# EasyEDA Pro project ESP32_Expanded_Board.epro

# Schematic Schematic1_2
Board Name: 3.28新-tps5450降压-带总线舵机控制; Create Date: 2025-02-16; Page Name: P1; Project Name: ESP32S3控制板最终版; Schematic Name: Schematic1_2; Update Date: 2025-03-29; Company: 嘉立创EDA; Page Size: A4; Version: V1.0
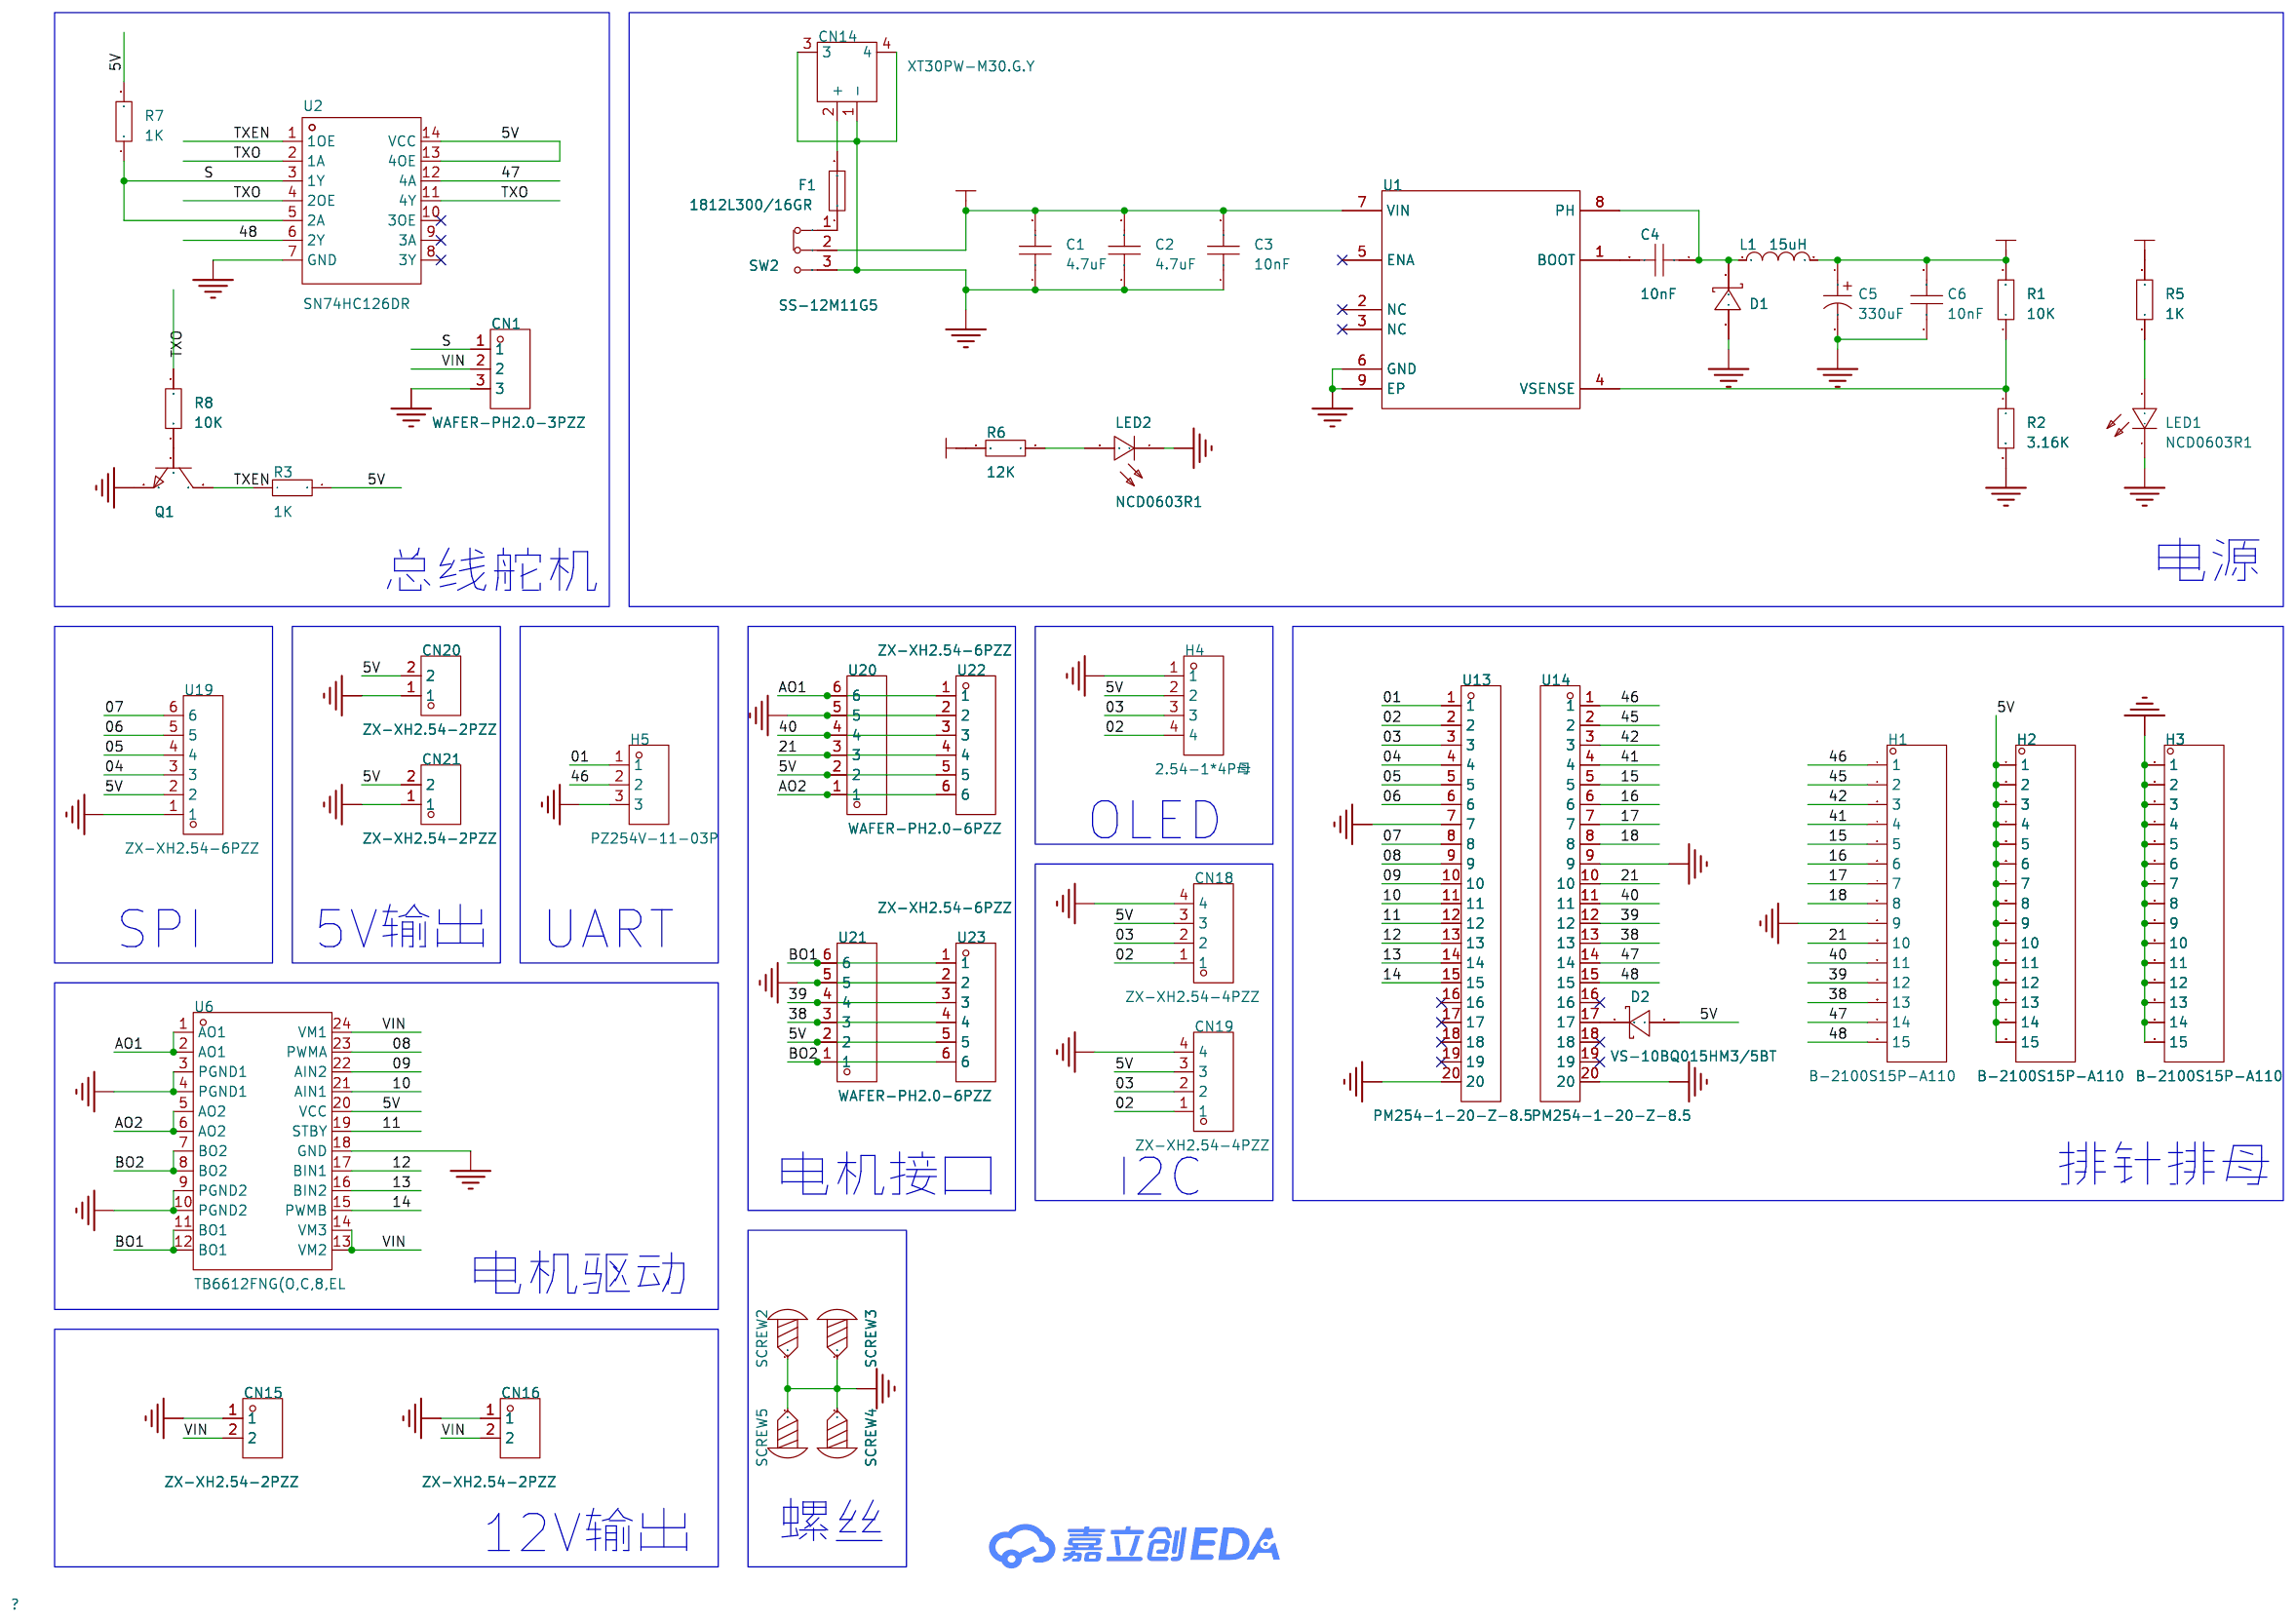
[diagram p0: schematic sheet]

## Parts
C1  4.7uF  [C0603]
C2  4.7uF  [C0603]
C3  10nF  [C0603]
C4  10nF  [C0603]
C5  330uF  [CAP-SMD_BD10.0-L10.3-W10.3-LS11.3-FD-1]
C6  10nF  [C0603]
CN1  WAFER-PH2.0-3PZZ  [CONN-TH_PH2.0D-L-3P]
CN14  XT30PW-M30.G.Y  [CONN-TH_XT30PW-M]
CN15  ZX-XH2.54-2PZZ  [CONN-TH_2P-P2.50_HX25003-2A]
CN16  ZX-XH2.54-2PZZ  [CONN-TH_2P-P2.50_HX25003-2A]
CN18  ZX-XH2.54-4PZZ  [CONN-TH_4P-P2.50_4PIN]
CN19  ZX-XH2.54-4PZZ  [CONN-TH_4P-P2.50_4PIN]
CN20  ZX-XH2.54-2PZZ  [CONN-TH_2P-P2.50_HX25003-2A]
CN21  ZX-XH2.54-2PZZ  [CONN-TH_2P-P2.50_HX25003-2A]
D1  B540C-13-F  [SMC_L7.1-W6.2-LS8.1-RD]
D2  VS-10BQ015HM3/5BT  [SMB_L4.6-W3.6-LS5.3-RD]
F1  1812L300/16GR  [F1812]
H1  B-2100S15P-A110  [HDR-TH_15P-P2.54-V-M]
H2  B-2100S15P-A110  [HDR-TH_15P-P2.54-V-M]
H3  B-2100S15P-A110  [HDR-TH_15P-P2.54-V-M]
H4  2.54-1*4P母  [HDR-TH_4P-P2.54-V-F]
H5  PZ254V-11-03P  [HDR-TH_3P-P2.54-V-M]
L1  15uH  [IND-SMD_L11.5-W10.0_FXL1040]
LED1  NCD0603R1  [LED0603-RD_RED]
LED2  NCD0603R1  [LED0603-RD_RED]
Q1  -  [S8050_SOT-23]
R1  10K  [R0603]
R2  3.16K  [R0603]
R3  1K  [R0603]
R5  1K  [R0603]
R6  12K  [R0603]
R7  1K  [R0603]
R8  10K  [R0603]
SCREW2  -  [M2螺丝]
SCREW3  -  [M2螺丝]
SCREW4  -  [M2螺丝]
SCREW5  -  [M2螺丝]
SW2  SS-12M11G5  [SW-TH_XKB_SS-12M11XX]
U1  TPS5450DDAR  [SOP-8_L4.9-W3.9-P1.27-LS6.0-BL-EP]
U2  SN74HC126DR  [SOIC-14_L8.7-W3.9-P1.27-LS6.0-BL]
U6  TB6612FNG(O,C,8,EL  [SSOP-24_L8.4-W5.8-P0.65-LS7.8-BL]
U13  PM254-1-20-Z-8.5  [HDR-TH_20P-P2.54-V-F-2]
U14  PM254-1-20-Z-8.5  [HDR-TH_20P-P2.54-V-F-2]
U19  ZX-XH2.54-6PZZ  [CONN-TH_6P-P2.50_ZX-XH2.54-6PZZ]
U20  WAFER-PH2.0-6PZZ  [CONN-TH_6P-P2.00_PH2.0-6P]
U21  WAFER-PH2.0-6PZZ  [CONN-TH_6P-P2.00_PH2.0-6P]
U22  ZX-XH2.54-6PZZ  [CONN-TH_6P-P2.50_ZX-XH2.54-6PZZ]
U23  ZX-XH2.54-6PZZ  [CONN-TH_6P-P2.50_ZX-XH2.54-6PZZ]

## Library data of the parts
C1-C4 C6 = CAP_0603: Supplier Footprint: 0603
C5 = RVT330UF50V167RV085: 容值:330uF;精度:±20%;额定电压:50V;纹波电流:170mA@120Hz;等效串联电阻:-;; LCSC Part Name: 330uF ±20% 50V; Supplier Part: C5155333; Manufacturer: KNSCHA(科尼盛); Supplier Footprint: SMD,D10xL10.2mm; JLCPCB Part Class: 扩展库; Datasheet: https://atta.szlcsc.com/upload/public/pdf/source/20220901/E823696ADB10689AF3B7DFC19BA73CDE.pdf; Supplier: LCSC; Tolerance: ±20%; Rated Voltage: 50V; Ripple Current: 170mA@120Hz; φD: 10mm; L: 10.2mm; Lifetime @ Temp: 2000hrs@105℃; Operating Temperature: -55℃~+105℃
CN1 = WAFER-PH2.0-3PZZ: 插针结构:1x3P;间距:2mm;安装方式:直插;参考系列:PH;总PIN数:3P;排数:1;每排PIN数:3;额定电流:2A;工作温度范围:-25℃~+85℃;; LCSC Part Name: PH 2.0mm 1x3P 直插; Supplier Part: C5359600; Manufacturer: XUNPU(讯普); Supplier Footprint: 插件,P=2mm; JLCPCB Part Class: 扩展库; Supplier: LCSC; Pins Structure: 1x3P; Pitch: 2mm; Mounting Style: 直插; Reference Series: PH; Number of Pins: 3P; Number of Rows: 1; Number of PINs Per Row: 3; Current Rating (Max): 2A; Operating Temperature Range: -25℃~+85℃
CN14 = XT30PW-M30.G.Y: 类别:-;类型1:-;; LCSC Part Name: AMASS(艾迈斯)航模插头 卧式弯脚 XT30PW-M公头; Supplier Part: C431092; Manufacturer: AMASS(艾迈斯); JLCPCB Part Class: 扩展库; Datasheet: https://atta.szlcsc.com/upload/public/pdf/source/20220222/6A9F22F7850E25B33E1BE430ADF8560B.pdf; Supplier: LCSC; Type: 航模插头; RatedVoltage: DC 500V; InterfaceType: 公头; RatedCurrent: 15A; RecommendedWireGauge: 16/18/20AWG; contact resistance: 1.2mΩ; specifications: 2pin
CN15 CN16 CN20 CN21 = ZX-XH2.54-2PZZ: 插针结构:1x2P;间距:2.54mm;安装方式:直插;参考系列:XH;总PIN数:2P;排数:1;每排PIN数:2;行距:-;额定电流:3A;触头材质:黄铜;触头镀层:锡;工作温度范围:-25℃~+85℃;; Supplier Part: C7429632; Manufacturer: Megastar(兆星); Supplier Footprint: 插件,P=2.54mm; JLCPCB Part Class: 扩展库; Datasheet: https://atta.szlcsc.com/upload/public/pdf/source/20230619/19BA6947230AA44A04D3EDD65E618FD0.pdf; Supplier: LCSC; Pins Structure: 1x2P; Pitch: 2.54mm; Mounting Style: 直插; Reference Series: XH; Number of Pins: 2P; Number of Rows: 1; Number of PINs Per Row: 2; Current Rating (Max): 3A; Contact Material: 黄铜; Contact Plating: 锡; Operating Temperature Range: -25℃~+85℃
CN18 CN19 = ZX-XH2.54-4PZZ: 插针结构:1x4P;间距:2.54mm;安装方式:直插;参考系列:XH;总PIN数:4P;排数:1;每排PIN数:4;行距:-;额定电流:3A;触头材质:黄铜;触头镀层:锡;工作温度范围:-25℃~+85℃;; Supplier Part: C7429634; Manufacturer: Megastar(兆星); Supplier Footprint: 插件,P=2.5mm; JLCPCB Part Class: 扩展库; Datasheet: https://atta.szlcsc.com/upload/public/pdf/source/20230619/B529A2163E0159A644AB3383D208FB03.pdf; Supplier: LCSC; Pins Structure: 1x4P; Pitch: 2.54mm; Mounting Style: 直插; Reference Series: XH; Number of Pins: 4P; Number of Rows: 1; Number of PINs Per Row: 4; Current Rating (Max): 3A; Contact Material: 黄铜; Contact Plating: 锡; Operating Temperature Range: -25℃~+85℃
D1 = B540C-13-F: 正向压降(Vf):550mV@5A;直流反向耐压(Vr):40V;平均整流电流(Io):5A;; LCSC Part Name: 电压:40V 电流:5A; Supplier Part: C72264; Manufacturer: DIODES(美台); Supplier Footprint: SMC(DO-214AB); JLCPCB Part Class: 扩展库; Datasheet: https://atta.szlcsc.com/upload/public/pdf/source/20171023/C134461_15087453602301052556.pdf; Supplier: LCSC; Forward Voltage (Vf@If): 550mV@5A; Reverse Voltage (Vr): 40V; Average Rectified Current (Io): 5A; Reverse Leakage Current (Ir): 500uA@40V
D2 = VS-10BQ015HM3/5BT: 正向压降(Vf):210mV@1A;直流反向耐压(Vr):15V;整流电流:1A;; LCSC Part Name: 电压:15V 电流:1A; Supplier Part: C413465; Manufacturer: VISHAY(威世); Supplier Footprint: DO-214AA(SMB); JLCPCB Part Class: 扩展库; Datasheet: https://atta.szlcsc.com/upload/public/pdf/source/20190819/C413465_3D2B1A8C7366D4425AB887DF85498F89.pdf; Supplier: LCSC; Forward Voltage (Vf@If): 210mV@1A; Reverse Voltage (Vr): 15V; Rectified Current: 1A; Reverse Leakage Current (Ir): 500uA@15V
F1 = 1812L300/16GR: 最大电压:16V;最大电流:40A;保持电流:3A;跳闸电流:5A;; LCSC Part Name: 16V 3A 自恢复保险丝; Supplier Part: C18198349; Manufacturer: LUTE(陆特); Supplier Footprint: 1812; JLCPCB Part Class: 扩展库; Datasheet: https://atta.szlcsc.com/upload/public/pdf/source/20230926/57461D6230B1C3E982BE957E074F147E.pdf; Supplier: LCSC; Operating Voltage (Max): 16V; Current Rating (Max): 40A; Hold Current: 3A; Trip Current: 5A; Power Dissipation: 1.4W; Resistance - Initial (Ri) (Min): 10mΩ; Resistance - Post Trip (R1) (Max): 50mΩ; Maximum Time to Trip: 4s; Operating Temperature: -40℃~+85℃
H1-H3 = B-2100S15P-A110: 插针结构:1x15P;间距:2.54mm;行距:-;圆针/方针:-;安装类型:直插;排数:单排;总PIN位数:15P;额定电流:-;额定电压:-;配合针长度:6mm;塑高:2.54mm;端接针长度:3mm;触头材质:黄铜;触头镀层:-;工作温度范围:-40℃~+105℃;颜色:黑色;; LCSC Part Name: 间距:2.54mm 1x15P 直插; Supplier Part: C124373; Manufacturer: Ckmtw(灿科盟); Supplier Footprint: 插件,P=2.54mm; JLCPCB Part Class: 扩展库; Datasheet: https://atta.szlcsc.com/upload/public/pdf/source/20170821/C124381_1503303309126901535.pdf; Supplier: LCSC; Pin Structure: 1x15P; Pitch: 2.54mm; Mounting Type: 直插; Number of Rows: 单排; Number of Pins: 15P; Length of Mating Pin: 6mm; Insulation Height: 2.54mm; Length of End Connection Pin: 3mm; Contact Material: 黄铜; Operating Temperature Range: -40℃~+105℃; Color: 黑色
H4 = 2.54-1*4P母: 插孔结构:1x4P;间距:2.54mm;行距:-;圆孔/方孔:方孔;安装类型:直插;排数:单排;总孔位数:4P;额定电流:3A;额定电压:-;插孔方向:顶部;塑高:-;触头材质:青铜;触头镀层:-;工作温度范围:-40℃~+105℃;焊接温度(最大值):-;; LCSC Part Name: 间距:2.54mm 1x4P 直插; Supplier Part: C2718488; Manufacturer: BOOMELE(博穆精密); Supplier Footprint: 插件,P=2.54mm; JLCPCB Part Class: 扩展库; Datasheet: https://atta.szlcsc.com/upload/public/pdf/source/20210301/C2718488_F4427B881E42CAA8DDB0B1C12B3A522C.pdf; Supplier: LCSC; Holes Structure: 1x4P; Pitch: 2.54mm; Circular Hole / Square Hole: 方孔; Mounting Type: 直插; Number of Rows: 单排; Number of Holes: 4P; Current Rating (Max): 3A; Holes Direction: 顶部; Contact Material: 青铜; Operating Temperature Range: -40℃~+105℃
H5 = PZ254V-11-03P: 插针结构:1x3P;间距:2.54mm;行距:-;圆针/方针:方针;安装类型:直插;排数:单排;总PIN位数:3P;额定电流:3A;额定电压:250V;配合针长度:6mm;塑高:2.5mm;端接针长度:3mm;工作温度范围:-40℃~+105℃;颜色:黑色;; LCSC Part Name: 间距:2.54mm 1x3P 直插 方针; Supplier Part: C2937625; Manufacturer: XFCN(兴飞); Supplier Footprint: 插件,P=2.54mm; JLCPCB Part Class: 扩展库; Datasheet: https://atta.szlcsc.com/upload/public/pdf/source/20200309/C492402_8335C3D49C4E4C618838D59BB1D024C1.pdf; Supplier: LCSC; Pin Structure: 1x3P; Pitch: 2.54mm; Circluar Pins/Square Pins: 方针; Mounting Type: 直插; Number of Rows: 单排; Number of Pins: 3P; Current Rating (Max): 3A; Voltage Rating (Max): 250V; Length of Mating Pin: 6mm; Insulation Height: 2.5mm; Length of End Connection Pin: 3mm; Operating Temperature Range: -40℃~+105℃; Color: 黑色
L1 = FXL1040-150-M: 电感值:15uH;精度:±20%;额定电流:6.5A;饱和电流(Isat):7A;类型:一体成型电感;; LCSC Part Name: 15uH ±20% 7A; Supplier Part: C475916; Manufacturer: cjiang(长江微电); Supplier Footprint: SMD,11.5x10mm; JLCPCB Part Class: 扩展库; Datasheet: https://atta.szlcsc.com/upload/public/pdf/source/20230516/54757DC4DB76FADFA619F78143C06647.pdf; Supplier: LCSC; Tolerance: ±20%; Rated Current: 6.5A; Saturation Current (Isat): 7A; DC Resistance (DCR): 45mΩ; Type: 一体成型电感
LED1 LED2 = NCD0603R1_C84263: 灯头类型:-;发光颜色:红色;正向电压(VF):1.6V~2.6V;功率:65mW;正向电流:20mA;主波长:615nm~630nm;二极管配置:独立二极管;透镜颜色:无色透明透镜;色温:-;发光强度:80mcd~220mcd;发光角度:130°;载带方式:-;工作温度:-30℃~+85℃;; Supplier Part: C84263; Manufacturer: 国星光电; Supplier Footprint: 0603; JLCPCB Part Class: 扩展库; Datasheet: https://atta.szlcsc.com/upload/public/pdf/source/20200820/C84263_DABC6A75E58F576973B407FDBA283D60.pdf; Supplier: LCSC; Emitted Color: 红色; Forward Voltage (VF): 1.6V~2.6V; Power Dissipation: 65mW; Forward Current: 20mA; Dominant Wavelength: 615nm~630nm; Diode Configuration: 独立二极管; Lens Color: 无色透明透镜; Luminous Intensity: 80mcd~220mcd; Viewing Angle: 130°; Operating Temperature: -30℃~+85℃
Q1 = S8050_SOT_NPN: Supplier Footprint: SOT-23
R1-R3 R5-R8 = Res_0603: Supplier Footprint: 0603
SCREW2-SCREW5 = M2螺丝: Supplier Footprint: 插件
SW2 = SS-12M11G5: 电路结构:单刀双掷;安装方式:直插;开关颜色:黑色;额定电流(DC):6A;额定电压(DC):120V;额定电流(AC):6A;额定电压(AC):120V;机械寿命:1万次;; LCSC Part Name: 柄长5mm 直插双档 滑动开关; Supplier Part: C2879839; Manufacturer: XKB Connectivity(中国星坤); Supplier Footprint: 插件; JLCPCB Part Class: 扩展库; Datasheet: https://atta.szlcsc.com/upload/public/pdf/source/20211009/04BB83002759118EAC16A9AC01596A50.pdf; Supplier: LCSC; Circuit: 单刀双掷; Actuator Style: 矩形柱状; Pin Style: PC引脚; Switch Length: 13mm; Switch Width: 7.2mm; Switch Height: 6.6mm; Mounting Style: 直插; Actuator Color: 黑色; Current Rating (DC): 6A; Voltage Rating (DC): 120V; Current Rating (AC): 6A; Voltage Rating (AC): 120V; Mechanical Life: 1万次; Operating Temperature: -40℃~+85℃
U1 = TPS5450DDAR: 功能类型:降压型;输出类型:可调;输入电压:5.5V~36V;输出电压:1.221V~31.32V;输出电流(最大值):5A;; Supplier Part: C114425; Manufacturer: TI(德州仪器); Supplier Footprint: SOP-8-EP-150mil; JLCPCB Part Class: 扩展库; Datasheet: https://www.ti.com/cn/lit/gpn/tps5450; Supplier: LCSC; Function: 降压型; Output Type: 可调; Input Voltage: 5.5V~36V; Output Voltage: 1.221V~31.32V; Output Current (Max): 5A; Switching Frequency: 500kHz; Operating Temperature: -40℃~+125℃@(TJ); Synchronous Rectification: 否; Number of Outputs: 1; Topology: 降压式; Switch tube (built-in/external): 内置
U2 = SN74HC126DR: 输入类型:-;电源电压:2V~6V;元件数:4;每个元件位数:1;灌电流(IOL):7.8mA;拉电流(IOH):7.8mA;; Supplier Part: C7644; Manufacturer: TI(德州仪器); Supplier Footprint: SOIC-14; JLCPCB Part Class: 扩展库; Datasheet: https://www.ti.com/cn/lit/gpn/sn74hc126; Supplier: LCSC; output type: 三态; Supply Voltage: 2V~6V; Number of Elements: 4; Number of Bits per Element: 1; Sink Current: 7.8mA; Source Current: 7.8mA; Logic Family: 74HC; Operating Temperature: -40℃~+85℃
U6 = TB6612FNG(O,C,8,EL: 双直流电机驱动器集成电路; Supplier Part: C88224; Manufacturer: TOSHIBA(东芝); Supplier Footprint: SSOP-24-208mil; JLCPCB Part Class: 扩展库; Datasheet: https://atta.szlcsc.com/upload/public/pdf/source/20171128/C141517_15118625624231147036.pdf; Supplier: LCSC
U13 U14 = PM254-1-20-Z-8.5: 插孔结构:1x20P;间距:2.54mm;行距:-;圆孔/方孔:方孔;安装类型:直插;排数:单排;总孔位数:20P;额定电流:3A;额定电压:-;插孔方向:顶部;塑高:8.5mm;触头材质:铜合金;工作温度范围:-40℃~+105℃;焊接温度(最大值):260℃@5S;; LCSC Part Name: 1x20P 间距:2.54mm 直插; Supplier Part: C2897383; Manufacturer: HCTL(华灿天禄); Supplier Footprint: 插件,P=2.54mm; JLCPCB Part Class: 扩展库; Datasheet: https://atta.szlcsc.com/upload/public/pdf/source/20230609/534BE42964C679BDE98E061007C4ABD6.pdf; Supplier: LCSC; Holes Structure: 1x20P; Pitch: 2.54mm; Circular Hole / Square Hole: 方孔; Mounting Type: 直插; Number of Rows: 单排; Number of Holes: 20P; Current Rating (Max): 3A; Holes Direction: 顶部; Insulation Height: 8.5mm; Contact Material: 铜合金; Operating Temperature Range: -40℃~+105℃; Soldering Temperature(Max): 260℃@5S
U19 U22 U23 = ZX-XH2.54-6PZZ: 插针结构:1x6P;间距:2.54mm;安装方式:直插;参考系列:XH;总PIN数:6P;排数:1;每排PIN数:6;行距:-;额定电流:3A;触头材质:黄铜;触头镀层:锡;工作温度范围:-25℃~+85℃;; LCSC Part Name: 配套胶壳型号：ZX-XH2.54-6PJK 配套端子型号：ZX-XH2.54-DZ 配套杜邦线型号：ZX-XH2.54-6PBXC; Supplier Part: C7429636; Manufacturer: Megastar(兆星); Supplier Footprint: 插件,P=2.54mm; JLCPCB Part Class: 扩展库; Datasheet: https://atta.szlcsc.com/upload/public/pdf/source/20230619/1243AD0A516E39CD3D274D8985780568.pdf; Supplier: LCSC; Pins Structure: 1x6P; Pitch: 2.54mm; Mounting Style: 直插; Reference Series: XH; Number of Pins: 6P; Number of Rows: 1; Number of PINs Per Row: 6; Current Rating (Max): 3A; Contact Material: 黄铜; Contact Plating: 锡; Operating Temperature Range: -25℃~+85℃
U20 U21 = WAFER-PH2.0-6PZZ: 插针结构:1x6P;间距:2mm;安装方式:直插;参考系列:PH;总PIN数:6P;排数:1;每排PIN数:6;额定电流:2A;工作温度范围:-25℃~+85℃;; LCSC Part Name: PH 2.0mm 1x6P 直插; Supplier Part: C5359603; Manufacturer: XUNPU(讯普); Supplier Footprint: 插件,P=2mm; JLCPCB Part Class: 扩展库; Supplier: LCSC; Pins Structure: 1x6P; Pitch: 2mm; Mounting Style: 直插; Reference Series: PH; Number of Pins: 6P; Number of Rows: 1; Number of PINs Per Row: 6; Current Rating (Max): 2A; Operating Temperature Range: -25℃~+85℃

## Nets
5V: C5.1 C6.2 CN18.3 CN19.3 CN20.2 CN21.2 D2.2(A) H2.1 H2.2 H2.3 H2.4 H2.5 H2.6 H2.7 H2.8 H2.9 H2.10 H2.11 H2.12 H2.13 H2.14 H2.15 H4.2 L1.2 R1.2 R3.2 R5.2 R7.2 U2.13(4OE) U2.14(VCC) U6.20(VCC) U19.2 U20.2 U21.2 U22.5 U23.5
GND: C1.1 C2.1 C3.1 C5.2 C6.1 CN1.3 CN14.1(-) CN14.3 CN14.4 CN15.1 CN16.1 CN18.4 CN19.4 CN20.1 CN21.1 D1.2(A) H1.9 H3.1 H3.2 H3.3 H3.4 H3.5 H3.6 H3.7 H3.8 H3.9 H3.10 H3.11 H3.12 H3.13 H3.14 H3.15 H4.1 H5.3 LED1.1(K) LED2.1(K) Q1.2 R2.2 SCREW2.1 SCREW3.1 SCREW4.1 SCREW5.1 SW2.3 U1.6(GND) U1.9(EP) U2.7(GND) U6.3(PGND1) U6.4(PGND1) U6.9(PGND2) U6.10(PGND2) U6.18(GND) U13.7 U13.20 U14.9 U14.20 U19.1 U20.5 U21.5 U22.2 U23.2
VIN: C1.2 C2.2 C3.2 CN1.2 CN15.2 CN16.2 R6.2 SW2.2 U1.7(VIN) U6.13(VM2) U6.14(VM3) U6.24(VM1)
01: H5.1 U13.1
02: CN18.1 CN19.1 H4.4 U13.2
03: CN18.2 CN19.2 H4.3 U13.3
04: U13.4 U19.3
05: U13.5 U19.4
06: U13.6 U19.5
07: U13.8 U19.6
08: U6.23(PWMA) U13.9
09: U6.22(AIN2) U13.10
10: U6.21(AIN1) U13.11
11: U6.19(STBY) U13.12
12: U6.17(BIN1) U13.13
13: U6.16(BIN2) U13.14
14: U6.15(PWMB) U13.15
15: H1.5 U14.5
16: H1.6 U14.6
17: H1.7 U14.7
18: H1.8 U14.8
21: H1.10 U14.10 U20.3 U22.4
38: H1.13 U14.13 U21.3 U23.4
39: H1.12 U14.12 U21.4 U23.3
40: H1.11 U14.11 U20.4 U22.3
41: H1.4 U14.4
42: H1.3 U14.3
45: H1.2 U14.2
46: H1.1 H5.2 U14.1
47: H1.14 U2.12(4A) U14.14
48: H1.15 U2.6(2Y) U14.15
AO1: U6.1(AO1) U6.2(AO1) U20.6 U22.1
AO2: U6.5(AO2) U6.6(AO2) U20.1 U22.6
BO1: U6.11(BO1) U6.12(BO1) U21.6 U23.1
BO2: U6.7(BO2) U6.8(BO2) U21.1 U23.6
S: CN1.1 R7.1 U2.3(1Y) U2.5(2A)
TXEN: Q1.3 R3.1 U2.1(1OE)
TXO: R8.1 U2.2(1A) U2.4(2OE) U2.11(4Y)
$1N21389: R1.1 R2.1 U1.4(VSENSE)
$1N21391: C4.1 D1.1(K) L1.1 U1.8(PH)
$1N28943: LED1.2(A) R5.1
$1N31451: F1.1 SW2.1
$1N31551: LED2.2(A) R6.1
$1N31886: C4.2 U1.1(BOOT)
$1N32079: CN14.2(+) F1.2
$1N33489: Q1.1 R8.2
$1N35001: D2.1(C) U14.17

Not connected (* = marked no-connect by the designer): U1 2(NC)* 3(NC)* 5(ENA)*; U2 8(3Y)* 9(3A)* 10(3OE)*; U13 16* 17* 18* 19*; U14 16* 18* 19*

## Notes on the sheet
- 总线舵机
- 电源
- OLED
- SPI
- 5V输出
- UART
- 排针排母
- 电机接口
- I2C
- 电机驱动
- 12V输出
- 螺丝

# Board PCB1_2
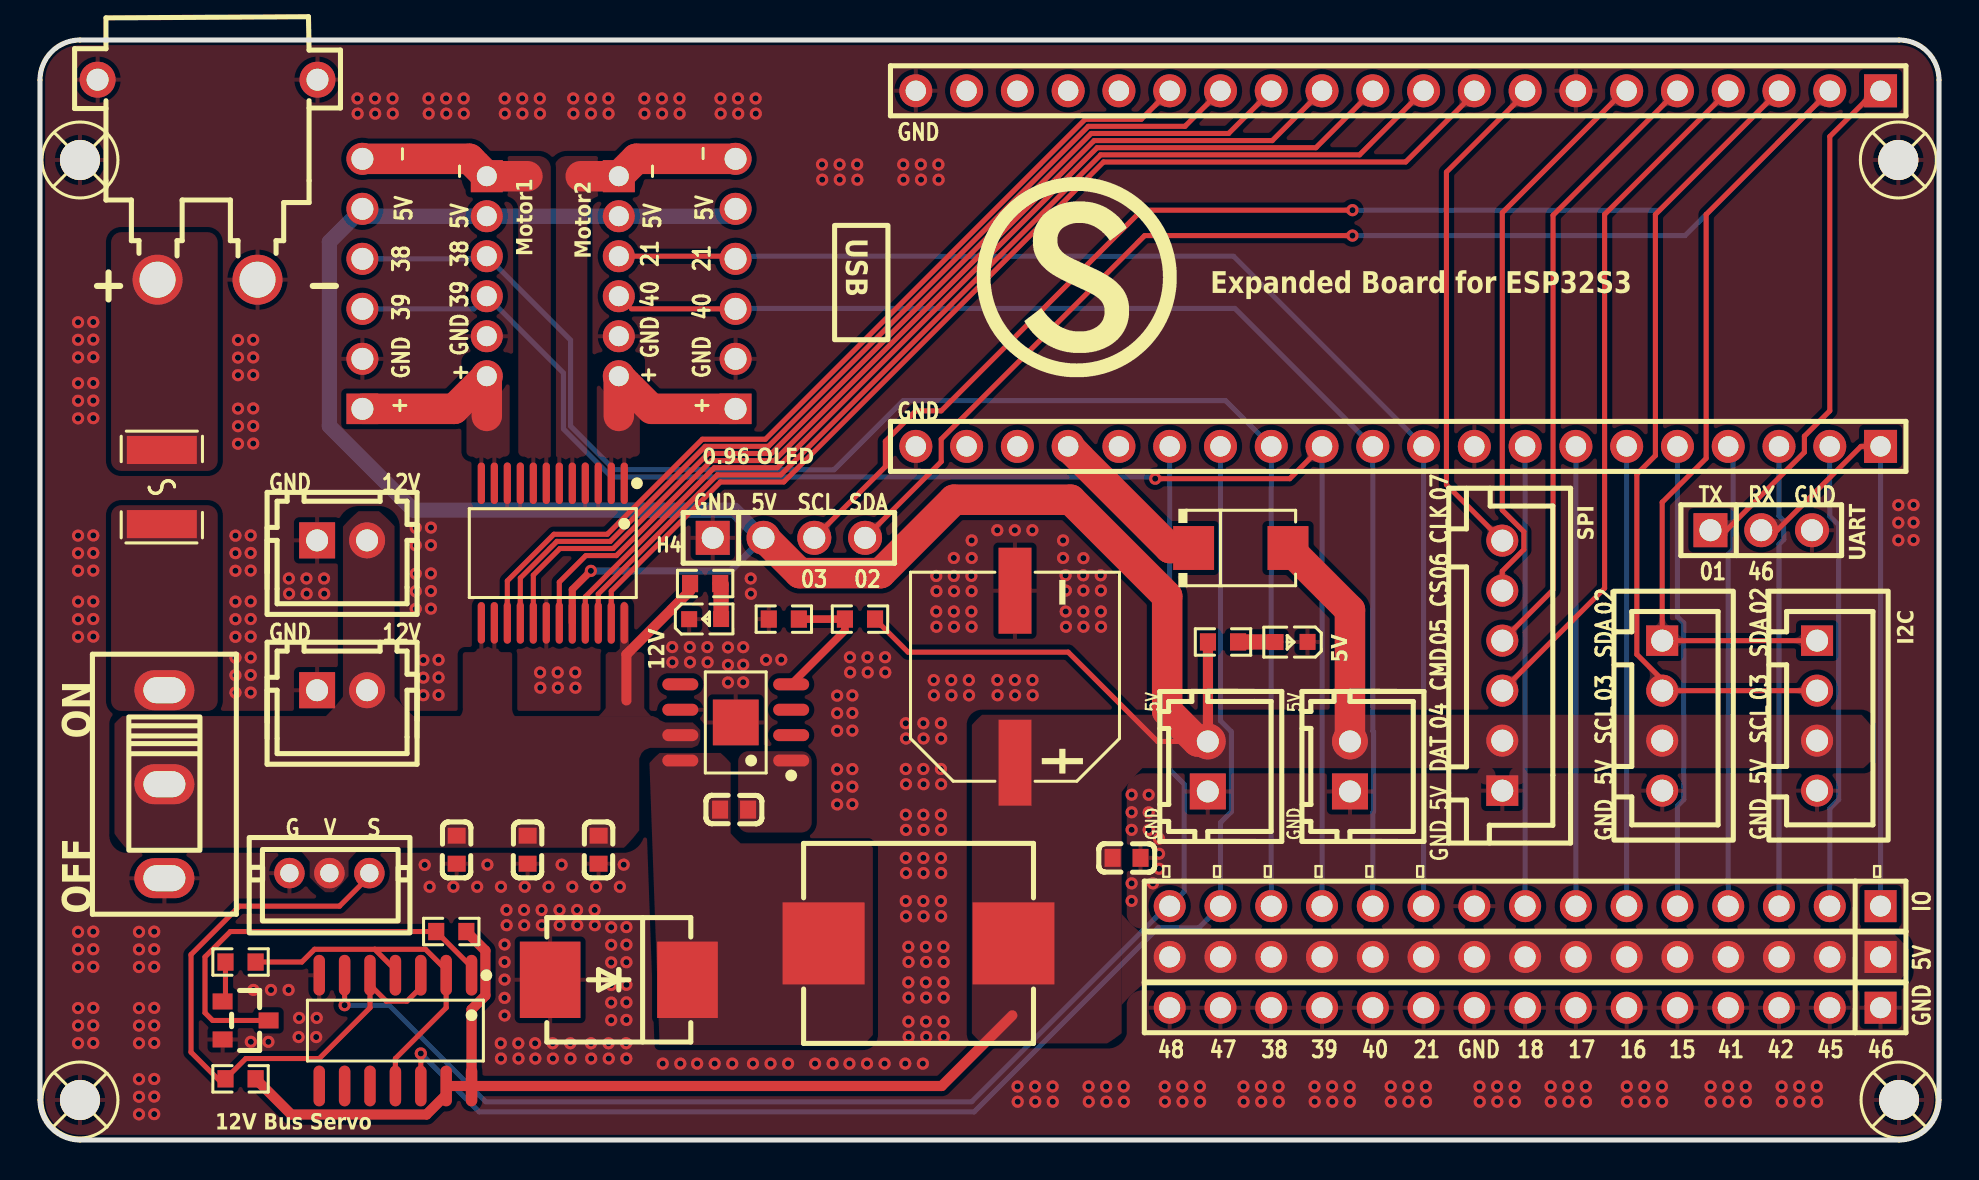
[diagram p1: board, top side]
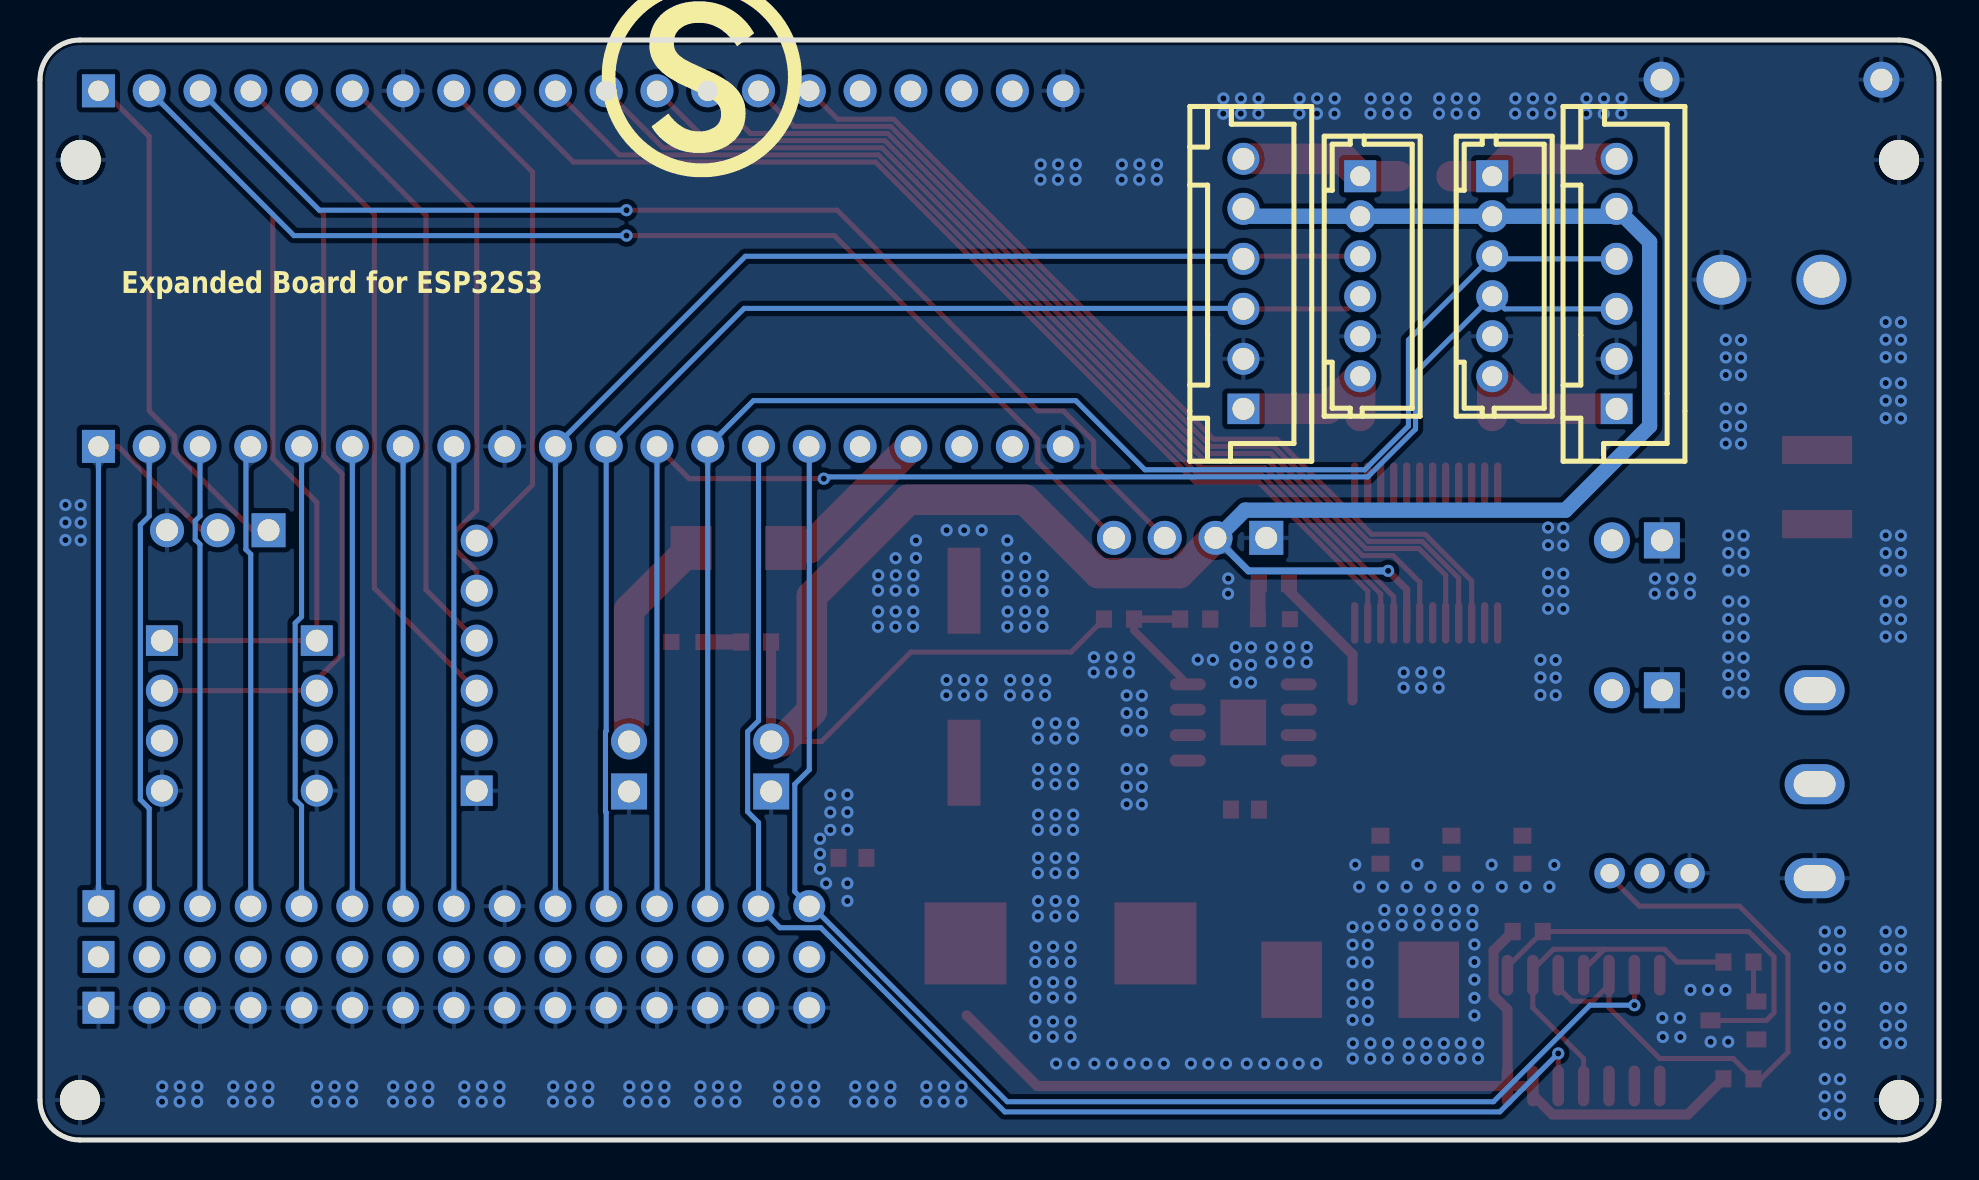
[diagram p2: board, bottom side, seen from below]

Outline 95 x 55 mm; copper layers: Top Layer, Bottom Layer. Coordinates in mm from the lower left corner of the outline.
Outline path: 0,53 0,2 arc(0.59,0.59) 2,0 93,0 arc(94.41,0.59) 95,2 95,53 arc(94.41,54.41) 93,55 2,55 arc(0.59,54.41) 0,53
Stack: Top Layer 0.035mm / Dielectric1 1.51mm FR4 er 4.5 / Bottom Layer 0.035mm

## Design rules (mm)
template: JLCPCB Capability(Two Layers Board)
spacing copperThickness1oz (default): track to track 0.102, other pairs 0.152 to 0.3
spacing copperThickness2oz: track to track 0.203, other pairs 0.152 to 0.3
track width copperThickness1oz (default): min 0.127, default 0.254, max 2.54
track width copperThickness2oz: min 0.203, default 0.254, max 2.54
differential pair differentialPair (default): width min 0.127, default 0.254, max 2.54; gap min 0.152, default 0.152
via viaSize (default): diameter min 0.5, default 0.61, max 10; hole min 0.3, default 0.305, max 6.3

## Placement (name value [footprint] x y rotation side)
C1  4.7uF  [C0603]  20.84 14.51 90 top
C2  4.7uF  [C0603]  24.39 14.51 90 top
C3  10nF  [C0603]  27.94 14.51 90 top
C4  10nF  [C0603]  34.72 16.52 0 top
C5  330uF  [CAP-SMD_BD10.0-L10.3-W10.3-LS11.3-FD-1]  48.78 23.16 90 top
C6  10nF  [C0603]  54.36 14.11 180 top
CN1  WAFER-PH2.0-3PZZ  [CONN-TH_PH2.0D-L-3P]  14.48 13.34 180 top
CN14  XT30PW-M30.G.Y  [CONN-TH_XT30PW-M]  8.38 48.02 180 top
CN15  ZX-XH2.54-2PZZ  [CONN-TH_2P-P2.50_HX25003-2A]  15.11 22.49 0 top
CN16  ZX-XH2.54-2PZZ  [CONN-TH_2P-P2.50_HX25003-2A]  15.11 29.98 0 top
CN18  ZX-XH2.54-4PZZ  [CONN-TH_4P-P2.50_4PIN]  81.15 21.22 270 top
CN19  ZX-XH2.54-4PZZ  [CONN-TH_4P-P2.50_4PIN]  88.9 21.22 270 top
CN20  ZX-XH2.54-2PZZ  [CONN-TH_2P-P2.50_HX25003-2A]  65.53 18.68 90 top
CN21  ZX-XH2.54-2PZZ  [CONN-TH_2P-P2.50_HX25003-2A]  58.42 18.68 90 top
D1  B540C-13-F  [SMC_L7.1-W6.2-LS8.1-RD]  28.96 8.01 180 top
D2  VS-10BQ015HM3/5BT  [SMB_L4.6-W3.6-LS5.3-RD]  60.07 29.6 0 top
F1  1812L300/16GR  [F1812]  6.1 32.65 90 top
H1  B-2100S15P-A110  [HDR-TH_15P-P2.54-V-M]  74.3 11.69 180 top
H2  B-2100S15P-A110  [HDR-TH_15P-P2.54-V-M]  74.3 9.15 180 top
H3  B-2100S15P-A110  [HDR-TH_15P-P2.54-V-M]  74.3 6.61 180 top
H4  2.54-1*4P母  [HDR-TH_4P-P2.54-V-F]  37.46 30.11 0 top
H5  PZ254V-11-03P  [HDR-TH_3P-P2.54-V-M]  86.11 30.49 0 top
L1  15uH  [IND-SMD_L11.5-W10.0_FXL1040]  43.95 9.83 0 top
LED1  NCD0603R1  [LED0603-RD_RED]  62.61 24.9 180 top
LED2  NCD0603R1  [LED0603-RD_RED]  33.27 26.04 0 top
Q1  -  [S8050_SOT-23]  10.29 6.11 180 top
R1  10K  [R0603]  41.02 26.04 0 top
R2  3.16K  [R0603]  37.21 26.04 180 top
R3  1K  [R0603]  20.57 10.42 0 top
R5  1K  [R0603]  59.18 24.9 180 top
R6  12K  [R0603]  33.27 27.82 180 top
R7  1K  [R0603]  10.03 3.06 0 top
R8  10K  [R0603]  10.03 8.9 180 top
SCREW2  -  [M2螺丝]  2 2 0 top
SCREW3  -  [M2螺丝]  93 2 0 top
SCREW4  -  [M2螺丝]  92.96 49 0 top
SCREW5  -  [M2螺丝]  2 49 0 top
SW2  SS-12M11G5  [SW-TH_XKB_SS-12M11XX]  6.22 17.79 270 top
U1  TPS5450DDAR  [SOP-8_L4.9-W3.9-P1.27-LS6.0-BL-EP]  34.81 20.88 90 top
U2  SN74HC126DR  [SOIC-14_L8.7-W3.9-P1.27-LS6.0-BL]  17.78 5.47 180 top
U6  TB6612FNG(O,C,8,EL  [SSOP-24_L8.4-W5.8-P0.65-LS7.8-BL]  25.65 29.35 180 top
U13  PM254-1-20-Z-8.5  [HDR-TH_20P-P2.54-V-F-2]  67.95 52.46 180 top
U14  PM254-1-20-Z-8.5  [HDR-TH_20P-P2.54-V-F-2]  67.95 34.68 180 top
U19  ZX-XH2.54-6PZZ  [CONN-TH_6P-P2.50_ZX-XH2.54-6PZZ]  73.15 23.72 270 top
U20  WAFER-PH2.0-6PZZ  [CONN-TH_6P-P2.00_PH2.0-6P]  28.96 43.19 90 bottom
U21  WAFER-PH2.0-6PZZ  [CONN-TH_6P-P2.00_PH2.0-6P]  22.35 43.19 90 bottom
U22  ZX-XH2.54-6PZZ  [CONN-TH_6P-P2.50_ZX-XH2.54-6PZZ]  34.8 42.81 270 bottom
U23  ZX-XH2.54-6PZZ  [CONN-TH_6P-P2.50_ZX-XH2.54-6PZZ]  16.13 42.81 270 bottom

## Footprints (pads in the part's own frame, mm; a bottom-side part is the same pattern mirrored in y, then rotated)
C0603
  rect 0.8x0.9 smd: 1(-0.7,0) 2(0.7,0)
CAP-SMD_BD10.0-L10.3-W10.3-LS11.3-FD-1
  rect 4.3x1.65 smd: 1(-4.3,0) 2(4.3,0)
CONN-TH_2P-P2.50_HX25003-2A
  rect 1.8x1.8 hole 1.1: 1(-1.25,0)
  round 1.8 hole 1.1: 2(1.25,0)
CONN-TH_4P-P2.50_4PIN
  rect 1.524x1.6 hole 1.1: 1(-3.75,0)
  round 1.6 hole 1.1: 2(-1.25,0) 3(1.25,0) 4(3.75,0)
CONN-TH_6P-P2.00_PH2.0-6P
  rect 1.6x1.6 hole 1: 1(5,0)
  round 1.6 hole 1: 2(3,0) 3(1,0) 4(-1,0) 5(-3,0) 6(-5,0)
CONN-TH_6P-P2.50_ZX-XH2.54-6PZZ
  rect 1.524x1.6 hole 1.1: 1(6.25,0)
  round 1.6 hole 1.1: 2(3.75,0) 3(1.25,0) 4(-1.25,0) 5(-3.75,0) 6(-6.25,0)
CONN-TH_PH2.0D-L-3P
  round 1.524 hole 0.914: 1(-2,0) 2(0,0) 3(2,0)
CONN-TH_XT30PW-M
  round 2.5 hole 1.8: 1(-2.5,5) 2(2.5,5)
  round 1.8 hole 1.1: 3(5.5,-5) 4(-5.5,-5)
F1812
  rect 1.407x3.499 smd: 1(-1.853,0) 2(1.853,0)
HDR-TH_3P-P2.54-V-M
  rect 1.7x1.7 hole 1.1: 1(-2.54,0)
  round 1.7 hole 1.1: 2(0,0) 3(2.54,0)
HDR-TH_4P-P2.54-V-F
  rect 1.7x1.7 hole 1.1: 1(-3.81,0)
  round 1.7 hole 1.1: 2(-1.27,0) 3(1.27,0) 4(3.81,0)
HDR-TH_15P-P2.54-V-M
  rect 1.6x1.6 hole 1.05: 1(-17.78,0)
  round 1.6 hole 1.05: 2(-15.24,0) 3(-12.7,0) 4(-10.16,0) 5(-7.62,0) 6(-5.08,0) 7(-2.54,0) 8(0,0) 9(2.54,0) 10(5.08,0) 11(7.62,0) 12(10.16,0) 13(12.7,0) 14(15.24,0) 15(17.78,0)
HDR-TH_20P-P2.54-V-F-2
  rect 1.65x1.65 hole 1.02: 1(-24.13,0)
  round 1.65 hole 1.02: 2(-21.59,0) 3(-19.05,0) 4(-16.51,0) 5(-13.97,0) 6(-11.43,0) 7(-8.89,0) 8(-6.35,0) 9(-3.81,0) 10(-1.27,0) 11(1.27,0) 12(3.81,0) 13(6.35,0) 14(8.89,0) 15(11.43,0) 16(13.97,0) 17(16.51,0) 18(19.05,0) 19(21.59,0) 20(24.13,0)
IND-SMD_L11.5-W10.0_FXL1040
  rect 4.1x4.1 smd: 1(-4.75,0) 2(4.75,0)
LED0603-RD_RED
  rect 0.8x0.8 smd: 1(-0.799,-0.004) 2(0.799,0.004)
M2螺丝
  round 2 hole 2: 1(0,0)
R0603
  rect 0.806x0.864 smd: 1(-0.753,0) 2(0.753,0)
S8050_SOT-23
  rect 1x0.8 smd: 1(1.15,-0.823) 2(1.15,1.077) 3(-1.15,0.127)
SMB_L4.6-W3.6-LS5.3-RD
  rect 2.047x2.192 smd: 1(-2.361,0) 2(2.361,0)
SMC_L7.1-W6.2-LS8.1-RD
  rect 3.03x3.82 smd: 1(-3.435,0) 2(3.435,0)
SOIC-14_L8.7-W3.9-P1.27-LS6.0-BL
  oval 0.574x2.038 smd: 1(-3.81,-2.769) 2(-2.54,-2.769) 3(-1.27,-2.769) 4(0,-2.769) 5(1.27,-2.769) 6(2.54,-2.769) 7(3.81,-2.769) 8(3.81,2.769) 9(2.54,2.769) 10(1.27,2.769) 11(0,2.769) 12(-1.27,2.769) 13(-2.54,2.769) 14(-3.81,2.769)
SOP-8_L4.9-W3.9-P1.27-LS6.0-BL-EP
  oval 0.6x1.8 smd: 1(-1.905,-2.772) 2(-0.635,-2.772) 3(0.635,-2.772) 4(1.905,-2.772) 5(1.905,2.772) 6(0.635,2.772) 7(-0.635,2.772) 8(-1.905,2.772)
  rect 2.29x2.29 smd: 9(0,0)
SSOP-24_L8.4-W5.8-P0.65-LS7.8-BL
  oval 0.364x2.082 smd: 1(-3.575,-3.491) 2(-2.925,-3.491) 3(-2.275,-3.491) 4(-1.625,-3.491) 5(-0.975,-3.491) 6(-0.325,-3.491) 7(0.325,-3.491) 8(0.975,-3.491) 9(1.625,-3.491) 10(2.275,-3.491) 11(2.925,-3.491) 12(3.575,-3.491) 13(3.575,3.491) 14(2.925,3.491) 15(2.275,3.491) 16(1.625,3.491) 17(0.975,3.491) 18(0.325,3.491) 19(-0.325,3.491) 20(-0.975,3.491) 21(-1.625,3.491) 22(-2.275,3.491) 23(-2.925,3.491) 24(-3.575,3.491)
SW-TH_XKB_SS-12M11XX
  oval 2x3 hole 1.3x2.1: 1(-4.7,0) 2(0,0) 3(4.7,0)

## Nets
As in the schematic.

Pads without a net: U1 2 3 5; U2 8 9 10; U13 16 17 18 19; U14 16 18 19

## Via types
v1: diameter 0.61, hole 0.305, Top Layer to Bottom Layer, 459 vias

## Routing (per net, layer and track width the routed paths; a pad name or vN(x,y) marks a point on that pad's centre or on a via; arc(x,y) is an arc through that point)
5V: length 183.5
  Top Layer w0.254: 57.91,19.93 55.9,19.93 51.43,24.39 43.43,24.39 R1.2
  Top Layer w0.355: U6.20 26.63,27.53 v1(27.56,28.46)
  Top Layer w0.508: U2.14 21.59,6.53 22.28,7.22 22.28,9.47 R3.2 ; U2.14 45.11,2.7 48.64,6.23 ; U2.14 20.32,2.7 20.32,2.26 19.34,1.28 12.57,1.28 R7.2 ; CN21.2 58.43,19.94 R5.2
  Top Layer w1.524: H4.2 36.24,30.11 38,28.34 42.05,28.34 45.72,32.01 51.56,32.01 56.39,27.19 56.39,21.45 57.91,19.93 CN21.2 ; D2.2 65.53,26.5 CN20.2
  Bottom Layer w0.355: H4.2 34.54,28.46 v1(27.56,28.46)
  Bottom Layer w0.762: H4.2 36.11,30.11 34.73,31.49 18.68,31.49 14.48,35.7 14.48,44.91 U23.5 16.5,46.19 U21.2 U20.2 34.3,46.19 ; 34.43,46.19 U22.5
GND:
  vias: v1(1.91,40.89) v1(1.91,40.01) v1(1.91,39.13) v1(1.91,37.84) v1(1.91,36.96) v1(1.91,36.08) v1(1.91,30.22) v1(1.91,29.34) v1(1.91,28.46) v1(1.91,26.92) v1(1.91,26.04) v1(1.91,25.16) v1(1.91,10.41) v1(1.91,9.53) v1(1.91,8.65) v1(1.91,6.6) v1(1.91,5.72) v1(1.91,4.84) v1(2.67,40.9) v1(2.67,40.02) v1(2.67,39.14) v1(2.67,37.85) v1(2.67,36.97) v1(2.67,36.09) v1(2.67,30.23) v1(2.67,29.35) v1(2.67,28.47) v1(2.67,26.93) v1(2.67,26.05) v1(2.67,25.17) v1(2.67,10.42) v1(2.67,9.54) v1(2.67,8.66) v1(2.67,6.61) v1(2.67,5.73) v1(2.67,4.85) v1(4.95,10.41) v1(4.95,9.53) v1(4.95,8.65) v1(4.95,6.6) v1(4.95,5.72) v1(4.95,4.84) v1(4.95,3.04) v1(4.95,2.16) v1(4.95,1.28) v1(5.71,10.42) v1(5.71,9.54) v1(5.71,8.66) v1(5.71,6.61) v1(5.71,5.73) v1(5.71,4.85) v1(5.71,3.05) v1(5.71,2.17) v1(5.71,1.29) v1(9.78,30.22) v1(9.78,29.34) v1(9.78,28.46) v1(9.78,26.92) v1(9.78,26.04) v1(9.78,25.16) v1(9.78,24.12) v1(9.78,23.24) v1(9.78,22.37) v1(9.91,40) v1(9.91,39.12) v1(9.91,38.24) v1(9.91,36.57) v1(9.91,35.69) v1(9.91,34.81) v1(10.54,30.23) v1(10.54,29.35) v1(10.54,28.47) v1(10.54,26.93) v1(10.54,26.05) v1(10.54,25.17) v1(10.54,24.13) v1(10.54,23.25) v1(10.54,22.37) v1(10.55,4.91) v1(10.67,40.01) v1(10.67,39.13) v1(10.67,38.25) v1(10.67,36.58) v1(10.67,35.7) v1(10.67,34.82) v1(10.68,7.5) v1(11.43,4.91) v1(11.56,7.5) v1(12.45,28.08) v1(12.46,27.31) v1(12.44,7.5) v1(12.96,6.11) v1(12.94,5.15) v1(13.33,28.08) v1(13.34,27.31) v1(13.84,6.11) v1(13.82,5.15) v1(14.21,28.08) v1(14.22,27.31) v1(15.88,52.08) v1(15.89,51.32) v1(16.76,52.08) v1(16.77,51.32) v1(17.64,52.08) v1(17.65,51.32) v1(18.8,30.61) v1(18.8,29.73) v1(18.8,28.31) v1(18.8,27.44) v1(18.8,26.56) v1(19.18,24) v1(19.18,23.12) v1(19.18,22.24) v1(19.25,13.76) v1(19.44,52.08) v1(19.45,51.32) v1(19.56,30.62) v1(19.56,29.74) v1(19.56,28.33) v1(19.56,27.45) v1(19.56,26.57) v1(19.49,12.66) v1(19.94,24.01) v1(19.94,23.13) v1(19.94,22.25) v1(20.31,52.08) v1(20.33,51.32) v1(20.68,12.66) v1(21.19,52.08) v1(21.2,51.32) v1(21.87,12.66) v1(22.38,13.77) v1(23.06,12.66) v1(23.05,4.84) v1(23.06,4.07) v1(23.25,52.08) v1(23.26,51.32) v1(23.24,9.78) v1(23.24,8.9) v1(23.24,8.02) v1(23.24,7.11) v1(23.24,6.23) v1(23.34,11.5) v1(23.35,10.74) v1(23.93,4.84) v1(23.94,4.07) v1(24.12,52.08) v1(24.14,51.32) v1(24.25,12.66) v1(24.21,11.5) v1(24.23,10.74) v1(24.77,4.84) v1(24.78,4.07) v1(25,52.08) v1(25.01,51.32) v1(25.02,23.38) v1(25.03,22.62) v1(25.09,11.5) v1(25.1,10.74) v1(25.44,12.66) v1(25.65,4.84) v1(25.66,4.07) v1(25.9,23.38) v1(25.91,22.62) v1(25.99,11.5) v1(26,10.74) v1(26.1,13.77) v1(26.53,4.84) v1(26.54,4.07) v1(26.67,52.08) v1(26.69,51.32) v1(26.63,12.66) v1(26.78,23.38) v1(26.79,22.62) v1(26.87,11.5) v1(26.88,10.74) v1(27.55,52.08) v1(27.56,51.32) v1(27.56,4.84) v1(27.57,4.07) v1(27.75,11.5) v1(27.76,10.74) v1(27.82,12.66) v1(28.43,52.08) v1(28.44,51.32) v1(28.44,4.84) v1(28.45,4.07) v1(28.58,10.64) v1(28.58,9.76) v1(28.58,8.88) v1(28.58,7.75) v1(28.58,6.87) v1(28.58,5.99) v1(29.01,12.66) v1(29.2,13.77) v1(29.34,10.65) v1(29.34,9.77) v1(29.34,8.89) v1(29.34,7.76) v1(29.34,6.88) v1(29.34,6) v1(29.32,4.84) v1(29.33,4.07) v1(30.23,52.08) v1(30.24,51.32) v1(31.11,52.08) v1(31.12,51.32) v1(31.15,3.82) v1(31.63,24.65) v1(31.64,23.89) v1(31.99,52.08) v1(32,51.32) v1(32.03,3.82) v1(32.51,24.65) v1(32.52,23.89) v1(32.87,3.82) v1(33.39,24.65) v1(33.4,23.89) v1(33.75,3.82) v1(34.04,52.08) v1(34.05,51.32) v1(34.42,24.63) v1(34.42,23.75) v1(34.42,22.87) v1(34.63,3.82) v1(34.92,52.08) v1(34.93,51.32) v1(35.18,24.64) v1(35.18,23.76) v1(35.18,22.88) v1(35.55,28.08) v1(35.56,27.31) v1(35.67,3.82) v1(35.8,52.08) v1(35.81,51.32) v1(36.32,24.01) v1(36.55,3.82) v1(37.08,24.02) v1(37.43,3.82) v1(38.77,3.82) v1(39.12,48.78) v1(39.13,48.02) v1(39.65,3.82) v1(39.88,22.22) v1(39.88,21.34) v1(39.88,20.46) v1(39.88,18.54) v1(39.88,17.66) v1(39.88,16.78) v1(40,48.78) v1(40.01,48.02) v1(40.52,24.14) v1(40.53,23.38) v1(40.49,3.82) v1(40.64,22.23) v1(40.64,21.35) v1(40.64,20.47) v1(40.64,18.55) v1(40.64,17.67) v1(40.64,16.79) v1(40.88,48.78) v1(40.89,48.02) v1(41.37,3.82) v1(41.4,24.14) v1(41.41,23.38) v1(42.28,24.14) v1(42.29,23.38) v1(42.25,3.82) v1(43.18,48.78) v1(43.2,48.02) v1(43.29,3.82) v1(43.31,20.84) v1(43.32,20.08) v1(43.31,18.55) v1(43.32,17.79) v1(43.31,16.27) v1(43.32,15.5) v1(43.31,14.11) v1(43.32,13.34) v1(43.31,11.95) v1(43.32,11.19) v1(43.44,9.66) v1(43.45,8.9) v1(43.44,7.88) v1(43.45,7.12) v1(43.44,5.92) v1(43.45,5.16) v1(44.06,48.78) v1(44.07,48.02) v1(44.17,3.82) v1(44.19,20.84) v1(44.2,20.08) v1(44.19,18.55) v1(44.2,17.79) v1(44.19,16.27) v1(44.2,15.5) v1(44.19,14.11) v1(44.2,13.34) v1(44.19,11.95) v1(44.2,11.19) v1(44.32,9.66) v1(44.33,8.9) v1(44.32,7.88) v1(44.33,7.12) v1(44.32,5.92) v1(44.33,5.16) v1(44.71,23) v1(44.72,22.23) v1(44.84,28.2) v1(44.85,27.44) v1(44.84,26.43) v1(44.85,25.66) v1(44.94,48.78) v1(44.95,48.02) v1(45.07,20.84) v1(45.08,20.08) v1(45.07,18.55) v1(45.08,17.79) v1(45.07,16.27) v1(45.08,15.5) v1(45.07,14.11) v1(45.08,13.34) v1(45.07,11.95) v1(45.08,11.19) v1(45.2,9.66) v1(45.21,8.9) v1(45.2,7.88) v1(45.21,7.12) v1(45.2,5.92) v1(45.21,5.16) v1(45.59,23) v1(45.6,22.23) v1(45.71,29.1) v1(45.71,28.2) v1(45.73,27.44) v1(45.71,26.43) v1(45.73,25.66) v1(46.47,23) v1(46.48,22.23) v1(46.61,29.98) v1(46.61,29.1) v1(46.59,28.2) v1(46.6,27.44) v1(46.59,26.43) v1(46.6,25.66) v1(47.89,30.49) v1(47.89,23) v1(47.9,22.24) v1(48.77,30.49) v1(48.77,23) v1(48.78,22.24) v1(48.9,2.68) v1(48.91,1.91) v1(49.65,30.49) v1(49.65,23) v1(49.66,22.24) v1(49.78,2.68) v1(49.79,1.91) v1(50.66,2.68) v1(50.67,1.91) v1(51.18,29.98) v1(51.18,29.1) v1(51.31,28.24) v1(51.32,27.47) v1(51.31,26.43) v1(51.32,25.66) v1(52.19,28.24) v1(52.2,29.09) v1(52.2,27.47) v1(52.19,26.43) v1(52.2,25.66) v1(52.46,2.68) v1(52.47,1.91) v1(53.07,28.24) v1(53.08,27.47) v1(53.07,26.43) v1(53.08,25.66) v1(53.33,2.68) v1(53.34,1.91) v1(54.21,2.68) v1(54.22,1.91) v1(54.61,17.27) v1(54.61,16.39) v1(54.61,15.51) v1(54.61,12.83) v1(54.61,11.95) v1(55.46,17.26) v1(55.46,16.38) v1(55.46,15.5) v1(55.68,12.83) v1(55.98,15.06) v1(55.98,14.31) v1(55.98,13.56) v1(56.27,2.68) v1(56.28,1.91) v1(57.14,2.68) v1(57.15,1.91) v1(58.02,2.68) v1(58.03,1.91) v1(60.2,2.68) v1(60.21,1.91) v1(61.08,2.68) v1(61.09,1.91) v1(61.96,2.68) v1(61.97,1.91) v1(63.76,2.68) v1(63.77,1.91) v1(64.64,2.68) v1(64.65,1.91) v1(65.52,2.68) v1(65.53,1.91) v1(67.57,2.68) v1(67.58,1.91) v1(68.45,2.68) v1(68.46,1.91) v1(69.33,2.68) v1(69.34,1.91) v1(72.01,2.68) v1(72.02,1.91) v1(72.89,2.68) v1(72.9,1.91) v1(73.77,2.68) v1(73.78,1.91) v1(75.57,2.68) v1(75.58,1.91) v1(76.45,2.68) v1(76.46,1.91) v1(77.33,2.68) v1(77.34,1.91) v1(79.38,2.68) v1(79.39,1.91) v1(80.26,2.68) v1(80.27,1.91) v1(81.14,2.68) v1(81.15,1.91) v1(83.57,2.68) v1(83.58,1.91) v1(84.45,2.68) v1(84.46,1.91) v1(85.33,2.68) v1(85.34,1.91) v1(87.13,2.68) v1(87.14,1.91) v1(88.01,2.68) v1(88.02,1.91) v1(88.88,2.68) v1(88.89,1.91) v1(92.96,31.74) v1(92.96,30.87) v1(92.96,29.99) v1(93.73,31.75) v1(93.73,30.88) v1(93.73,30)
VIN: length 7.2
  Top Layer w0.508: R6.2 32.52,27.46 29.34,24.28 29.34,21.98
01: length 26.1
  Top Layer w0.254: H5.1 84.37,30.49 88.27,34.39 88.27,35.19 89.53,36.46 89.53,50.17 91.82,52.46 U13.1
02: length 96.9
  Top Layer w0.254: v1(65.66,45.22) 55.26,45.22 45.08,35.04 45.08,33.92 H4.4 ; U13.2 83.35,46.28 83.35,34.08 81.15,31.89 CN18.1 CN19.1
  Bottom Layer w0.254: U13.2 82.3,45.22 v1(65.66,45.22)
03: length 99.5
  Top Layer w0.254: v1(65.66,46.49) 55.12,46.49 45.08,36.46 43.81,36.46 42.29,34.93 42.29,33.66 H4.3 ; U13.3 80.81,46.28 80.81,34.22 79.88,33.29 79.88,24.28 81.15,23.01 CN18.2 CN19.2
  Bottom Layer w0.254: U13.3 81.03,46.49 v1(65.66,46.49)
04: length 34.7
  Top Layer w0.254: U19.3 78.27,27.59 78.27,46.28 U13.4
05: length 31.1
  Top Layer w0.254: U13.5 75.69,46.24 75.69,27.51 U19.4
06: length 28.5
  Top Layer w0.254: U19.5 73.15,28.44 74.23,29.52 74.23,30.42 73.15,31.49 73.15,46.36 79.25,52.46 U13.6
07: length 25.3
  Top Layer w0.254: U13.8 74.3,52.33 70.36,48.4 70.36,32.76 U19.6
08: length 55.2
  Top Layer w0.254: U6.23 28.58,27.45 34.04,32.9 37.21,32.9 53.21,48.9 68.32,48.9 71.76,52.34 U13.9
09: length 53.2
  Top Layer w0.254: U6.22 27.93,27.3 33.88,33.26 37.06,33.26 53.06,49.26 66.01,49.26 U13.10
10: length 51.2
  Top Layer w0.254: U6.21 27.28,27.16 33.73,33.61 36.88,33.61 52.88,49.61 63.83,49.61 U13.11
11: length 50.4
  Top Layer w0.254: U13.12 61.64,49.97 52.73,49.97 36.73,33.97 33.58,33.97 28.83,29.22 27.3,29.22 25.98,27.89 U6.19
12: length 49.3
  Top Layer w0.254: U13.13 59.46,50.33 52.59,50.33 36.59,34.33 33.43,34.33 28.68,29.58 26.01,29.58 24.68,28.24 U6.17
13: length 47.4
  Top Layer w0.254: U13.14 57.28,50.68 52.44,50.68 36.44,34.68 33.28,34.68 28.53,29.93 25.86,29.93 24.03,28.1 U6.16
14: length 45.4
  Top Layer w0.254: U6.15 23.38,27.96 25.71,30.29 28.38,30.29 33.13,35.04 36.29,35.04 52.29,51.04 55.09,51.04 U13.15
15: length 23.2
  Bottom Layer w0.254: H1.5 81.92,16.7 82.23,17.02 82.23,25.85 81.92,26.16 U14.5
16: length 23
  Bottom Layer w0.254: U14.6 H1.6
17: length 23
  Bottom Layer w0.254: U14.7 H1.7
18: length 23
  Bottom Layer w0.254: U14.8 H1.8
21: length 67.3
  Top Layer w0.254: 34.92,44.06 34.8,44.19 ; U20.3 34.67,44.19
  Bottom Layer w0.254: U22.4 34.93,44.19 59.71,44.19 U14.10 H1.10
38: length 77.8
  Bottom Layer w0.254: H1.13 U14.13 59.31,36.97 43.18,36.97 39.73,33.51 28.73,33.51 26.54,35.7 26.54,40 U21.3 22.22,44.06 U23.4
39: length 77.3
  Top Layer w0.254: U14.12 62.52,33.07 v1(55.79,33.07)
  Bottom Layer w0.254: U14.12 H1.12 ; v1(55.79,33.07) 55.7,33.16 28.58,33.16 26.19,35.55 26.19,38.35 U21.4 21.72,41.56 U23.3
40: length 63.7
  Top Layer w0.254: 29.46,41.69 U20.4 ; U22.3 29.59,41.56
  Bottom Layer w0.254: U22.3 34.82,41.58 59.78,41.58 U14.11 66.67,20.45 66.71,20.42 66.71,16.41 66.67,16.38 H1.11
41: length 23.2
  Bottom Layer w0.254: U14.4 84.7,34.44 84.7,29.52 84.45,29.28 H1.4
42: length 23.2
  Bottom Layer w0.254: U14.3 86.99,31.2 87.23,30.96 87.23,30.02 86.99,29.78 H1.3
45: length 23.4
  Bottom Layer w0.254: H1.2 89.53,16.58 89.98,17.02 89.98,30.75 89.53,31.2 U14.2
46: length 30.7
  Top Layer w0.254: U14.1 91.1,34.68 86.91,30.49 H5.2
  Bottom Layer w0.254: U14.1 H1.1
47: length 70.5
  Top Layer w0.254: U2.12 v1(19.05,4.33)
  Bottom Layer w0.254: U14.14 59.05,20.96 59.6,20.42 59.6,16.41 59.05,15.87 H1.14 57.98,10.61 55.94,10.61 46.73,1.41 21.97,1.41 v1(19.05,4.33)
48: length 72.4
  Top Layer w0.254: U2.6 v1(15.24,6.74)
  Bottom Layer w0.254: v1(15.24,6.74) 17.46,6.74 22.29,1.91 46.61,1.91 56.39,11.69 H1.15 57.24,12.42 57.24,17.79 56.52,18.52 U14.15
AO1: length 8.2
  Top Layer w1.524: 30.46,36.69 U20.6 ; 28.96,38.06 28.96,36.2 ; U22.1 30.59,36.56
AO2: length 8.1
  Top Layer w1.524: 27.05,48.19 U20.1 29.83,49.06 U22.6
BO1: length 8.9
  Top Layer w1.524: U23.1 20.72,36.56 U21.6 22.35,36.2
BO2: length 8.6
  Top Layer w1.524: 24.38,48.19 U21.1 21.48,49.06 U23.6
S: length 32.1
  Top Layer w0.254: U2.5 16.51,7.76 ; 16.51,7.76 17.33,6.94 18.36,6.94 19.05,7.63 U2.3 ; 16.51,7.76 16.51,6.61 13.97,4.07 10.3,4.07 R7.1 9.09,2.87 9.08,2.87 7.56,4.39 7.56,9.27 9.98,11.69 14.99,11.69 16.48,13.19 CN1.1
TXEN: length 21.1
  Top Layer w0.254: Q1.3 8.64,5.98 8.25,6.36 8.25,9.15 9.52,10.42 R3.1 21.59,8.65 U2.1
TXO: length 18.8
  Top Layer w0.254: R8.1 13.1,8.9 13.74,9.54 16.74,9.54 ; 16.74,9.54 19.28,9.54 20.32,8.5 20.32,6.61 17.78,4.07 U2.11 ; 16.74,9.54 17.78,8.5 U2.4
$1N21389: length 6.7
  Top Layer w0.381: R2.1 R1.1 40.27,25.47 U1.4
$1N28943: length 1.9
  Top Layer w0.762: R5.1 61.81,24.9 LED1.2
$1N31551: length 1.8
  Top Layer w0.762: LED2.2 34.07,27.78 R6.1
$1N33489: length 2
  Top Layer w0.254: Q1.1 9.28,7.07 R8.2
$1N35001: length 8.4
  Top Layer w1.524: U14.17 56.52,29.6 D2.1

## Copper pours and planes (outline as drawn; the poured copper is in the pictures)
5V on Top Layer: 46.62,21.26 91.58,21.26 91.58,4.83 46.62,4.83
5V on Top Layer: 54.1,11.31 93.47,11.31 93.47,6.74 54.1,6.74
GND on Top Layer: -1.52,56.02 96.39,56.02 96.39,-1.39 -1.52,-1.39
GND on Bottom Layer: -1.02,55.89 95.89,55.89 95.89,-0.63 -1.02,-0.63
VIN on Top Layer: 14.26,31.44 18.73,31.44 18.73,21.15 14.26,21.15
VIN on Top Layer: 3.73,21.2 33.03,21.2 33.03,14.61 3.73,14.61
VIN on Top Layer: 23.62,21.6 23.71,21.27 23.98,21.07 20.8,21.07 21.07,21.27 21.15,21.6 21.15,24.27 21.19,24.36 21.28,24.39 21.66,24.39 21.8,24.44 21.86,24.57 21.86,26.69 21.92,26.85 22.08,26.93 22.73,26.93 22.87,26.87 22.94,26.73 22.94,24.55 23,24.43 23.11,24.39 23.49,24.39 23.58,24.36 23.62,24.27
VIN on Top Layer: 12.82,14.68 16.12,14.68 16.12,12.39 12.82,12.39
VIN on Top Layer: 27.95,26.93 30.57,26.93 30.57,21.19 27.95,21.19
AO1 on Top Layer: 29.32,31.76 29.45,31.82 29.5,31.95 29.5,33.92 29.58,34.1 29.76,34.17 29.93,34.24 30.01,34.42 30.01,38.94 29.93,39.09 29.76,39.12 28.1,39.12 27.93,39.08 27.85,38.92 27.85,34.43 27.93,34.25 28.28,34.1 28.36,33.92 28.36,31.91 28.41,31.8 28.52,31.76
BO1 on Top Layer: 22.8,31.76 22.93,31.82 22.99,31.95 22.99,33.92 23.06,34.1 23.24,34.17 23.42,34.24 23.49,34.42 23.49,38.94 23.41,39.09 23.24,39.12 21.58,39.12 21.41,39.08 21.34,38.92 21.34,34.43 21.41,34.25 21.77,34.1 21.84,33.92 21.84,31.91 21.89,31.8 22.01,31.76
$1N21391 on Top Layer: 30.49,19.35 41.66,19.35 41.66,4.75 30.49,4.75
$1N31451 on Top Layer: 3.56,31.74 8.89,31.74 8.89,21.45 3.56,21.45
$1N31886 on Top Layer: 34.92,19.44 38.61,19.44 38.61,15.38 34.92,15.38
$1N32079 on Top Layer: 3.56,45.39 8.89,45.39 8.89,33.45 3.56,33.45
AO2 on Top Layer: 25.73,33.92 25.73,31.95 25.78,31.82 25.91,31.76 26.71,31.76 26.82,31.8 26.87,31.91 26.87,33.92 26.95,34.1 27.3,34.25 27.38,34.43 27.38,46.49 27.54,46.96 27.99,47.18 28.96,47.18 29.97,48.19 28.96,49.2 26.36,49.2 25.92,49.02 25.73,48.58
BO2 on Top Layer: 25.56,31.95 25.51,31.83 25.4,31.76 24.6,31.76 24.49,31.8 24.44,31.91 24.44,33.92 24.36,34.1 24,34.25 23.93,34.43 23.93,46.49 23.76,46.96 23.31,47.18 22.35,47.18 21.34,48.19 22.35,49.2 24.95,49.2 25.38,49.02 25.56,48.58

Small or netless copper shapes (teardrops, artwork), in the pictures only: 40 on Top Layer, 31 on Bottom Layer

## Text on the board
Bottom Silkscreen Layer: Expanded Board for ESP32S3
Top Silkscreen Layer: 5V | GND | G | V | S | 12V | SCL | 03 | SDA | 02 | 48 | 47 | 38 | 39 | 40 | 21 | 18 | 17 | 16 | 15 | TX | 01 | 41 | 46 | RX | 42 | 45 | + | - | 07 | CLK | 06 | CS | 05 | CMD | 04 | DAT | IO | I2C | SPI | 0.96 OLED | Motor1 | Motor2 | UART | 12V Bus Servo | Expanded Board for ESP32S3 | USB | ON | OFF | ❌
